# Altium schematic sheet E_M BOX.SchDoc
size A4
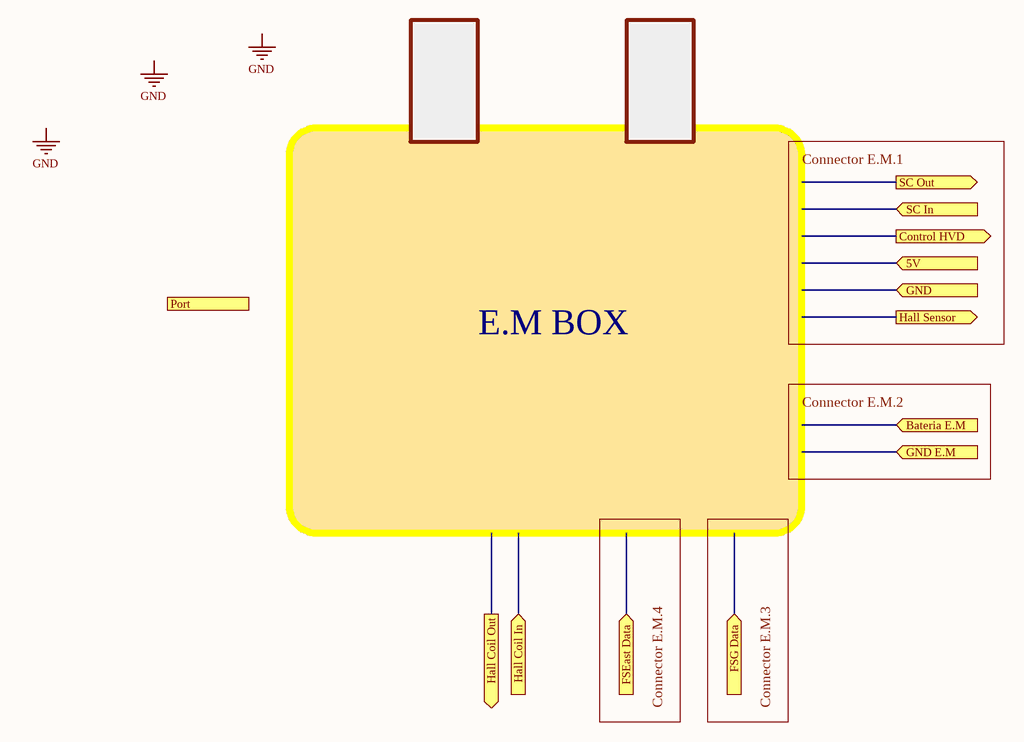
[diagram p0: E_M BOX.SchDoc]

## Ports
5V (in), Bateria E.M (in), Control HVD (out), FSEast Data (in), FSG Data (in), GND (in), GND E.M (in), Hall Coil In (in), Hall Coil Out (out), Hall Sensor (out), Port, SC In (in), SC Out (out)

## Notes on the sheet
- Connector E.M.1
- E.M BOX
- Connector E.M.2
- Connector E.M.4
- Connector E.M.3
- Labels drawn without touching a wire or pin: GND